# EAGLE design analog_rev_1 (EAGLE 6.3)
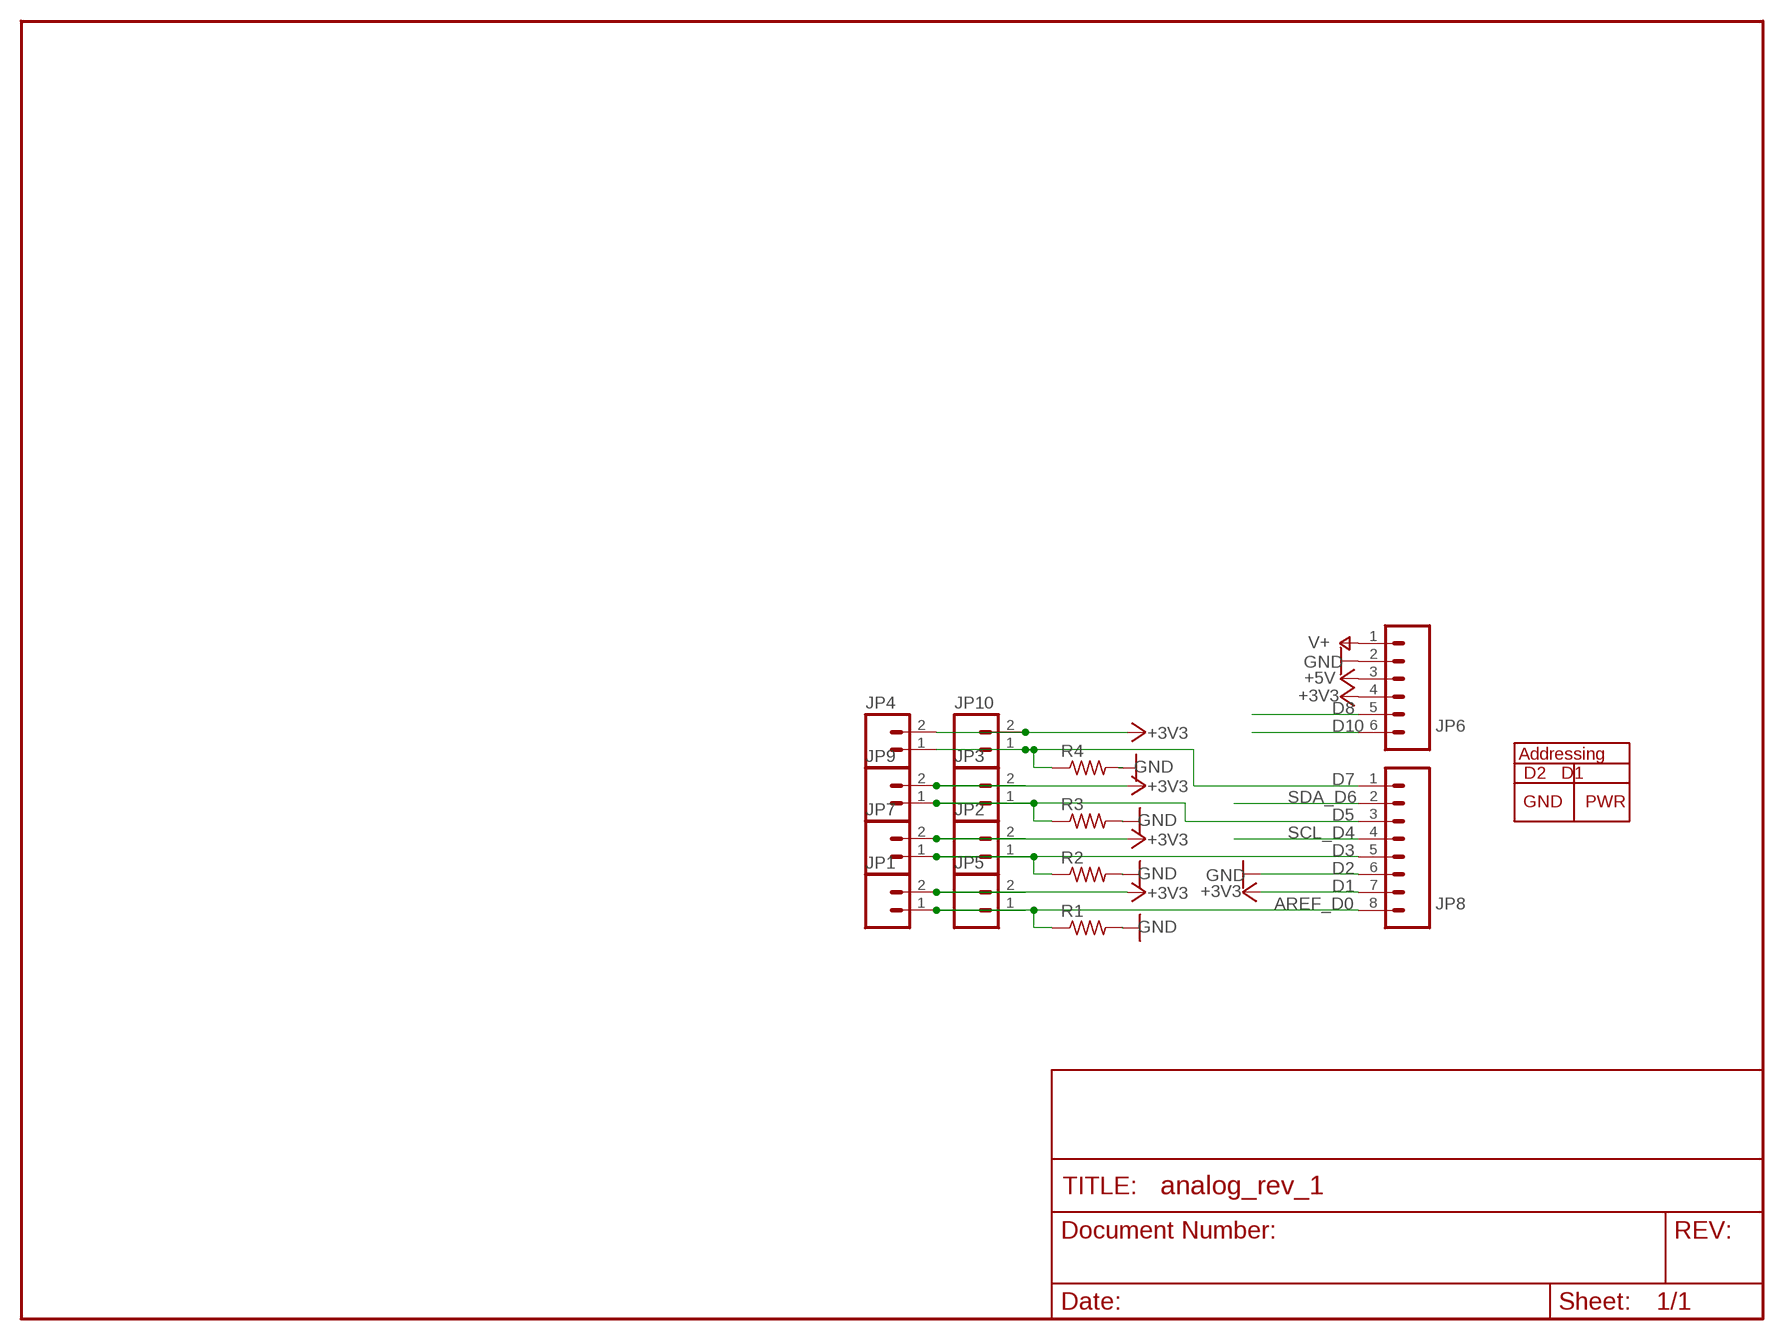
[diagram p0: schematic, sheet 1]

## Parts
JP1  M02PTH  [1X02]
JP2  M02PTH  [1X02]
JP3  M02PTH  [1X02]
JP4  M02PTH  [1X02]
JP5  M02PTH  [1X02]
JP6  M06SIP  [1X06]
JP7  M02PTH  [1X02]
JP8  M081X08  [1X08]
JP9  M02PTH  [1X02]
JP10  M02PTH  [1X02]
R1  R-US_0204/7  [0204/7]
R2  R-US_0204/7  [0204/7]
R3  R-US_0204/7  [0204/7]
R4  R-US_0204/7  [0204/7]

## Nets
+5V: JP6.3
AREF_D0: JP1.1 JP5.1 JP8.8 R1.1
D1: JP1.2 JP2.2 JP3.2 JP4.2 JP5.2 JP6.4 JP7.2 JP8.7 JP9.2 JP10.2 ; supply symbol labelled +3V3
D2: JP8.6 ; supply symbol labelled GND
D3: JP2.1 JP7.1 JP8.5 R2.1
D5: JP3.1 JP8.3 JP9.1 R3.1
D7: JP4.1 JP8.1 JP10.1 R4.1
D8: JP6.5
D10: JP6.6
GND: JP6.2 R1.2 R2.2 R3.2 R4.2
SCL_D4: JP8.4
SDA_D6: JP8.2
V+: JP6.1

## Library data of the parts
JP1-JP5 JP7 JP9 JP10 = SparkFun:M02: Header 2 Standard 2-pin 0.1" header. Use with straight break away headers (SKU : PRT-00116), right angle break away headers (PRT-00553), swiss pins (PRT-00743), machine pins (PRT-00117), and female headers (PRT-00115). Molex polarized connector foot print use with SKU : PRT-08233 with associated crimp pins and housings.
JP6 = SparkFun:M06: Header 6 Standard 6-pin 0.1" header. Use with straight break away headers (SKU : PRT-00116), right angle break away headers (PRT-00553), swiss pins (PRT-00743), machine pins (PRT-00117), and female headers (PRT-00115). Molex polarized connector foot print use with SKU : PRT-08094 with associated crimp pins and housings. NOTES ON THE VARIANTS LOCK and LOCK_LONGPADS... This footprint was designed to help hold the alignment of a through-hole component (i.e. 6-pin header) while soldering it into place. You may notice that each hole has been shifted either up or down by 0.005 of an inch from it's more standard position (which is a perfectly straight line). This slight alteration caused the pins (the squares in the middle) to touch the edges of the holes. Because they are alternating, it causes a "brace" to hold the component in place. 0.005 has proven to be the perfect amount of "off-center" position when using our standard breakaway headers. Although looks a little odd when you look at the bare footprint, once you have a header in there, the alteration is very hard to notice. Also, if you push a header all the way into place, it is covered up entirely on the bottom side. This idea of altering the position of holes to aid alignment will be further integrated into the Sparkfun Library for other footprints. It can help hold any component with 3 or more connection pins.
JP8 = SparkFun:M08: Header 8 Standard 8-pin 0.1" header. Use with straight break away headers (SKU : PRT-00116), right angle break away headers (PRT-00553), swiss pins (PRT-00743), machine pins (PRT-00117), and female headers (PRT-00115).
R1-R4 = adafruit_mod:R-US_: RESISTOR, American symbol

## Board
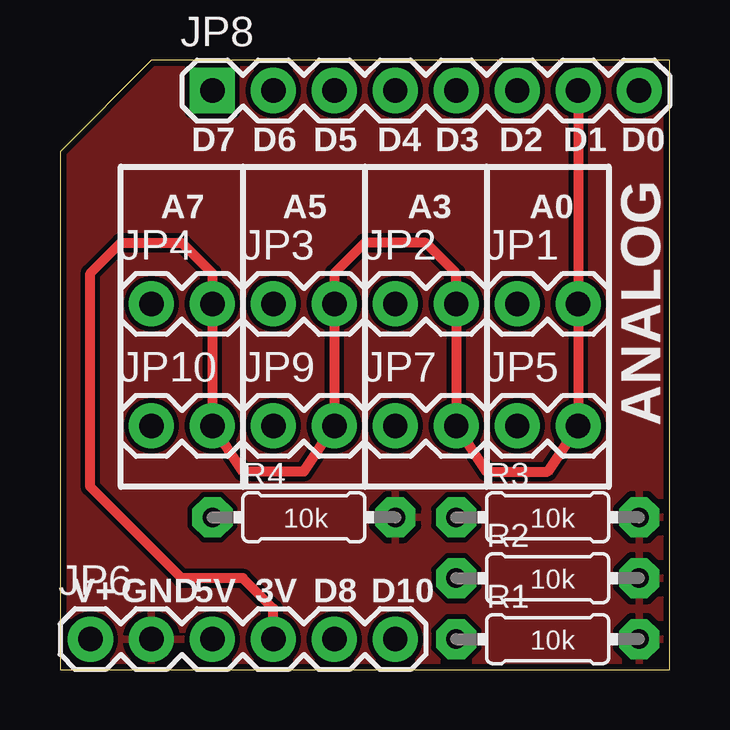
[diagram p1: board, top side]
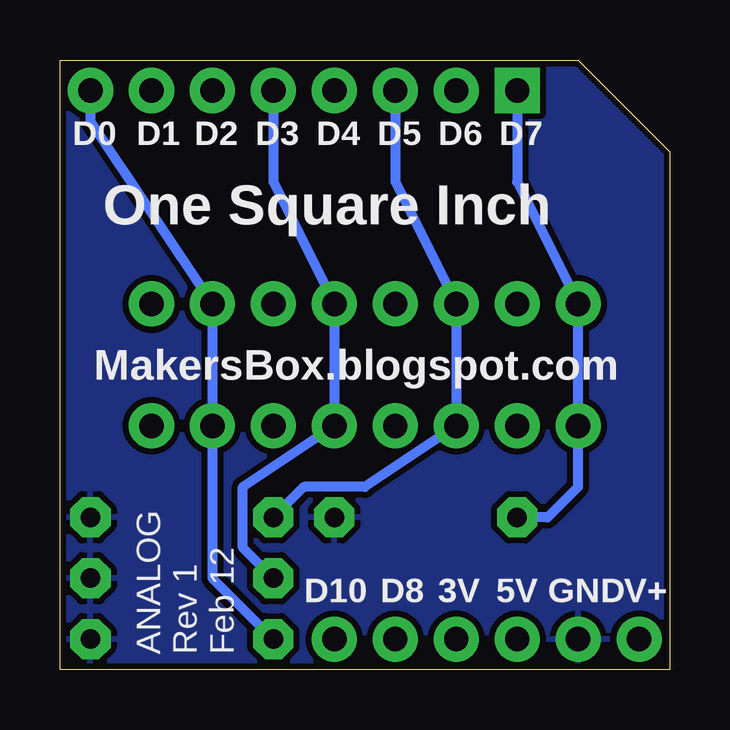
[diagram p2: board, bottom side, seen from below]

Size 25.4 x 25.4 mm. Coordinates in mm from the lower left corner, seen from the top.
Outline: 25.4,25.4 25.4,21.59 25.4,0 24.77,0 24.77,0 0,0 0,21.59
Outline: 25.4,25.4 3.81,25.4 0,21.59
Outline: 0,21.59 0,21.59
Copper layers (1*16): Top 0.035mm / dielectric 1.5mm / Bottom 0.035mm
Design rules "SparkFun": minimum track width 8mil, minimum drill 20mil, track to track 8mil, track to pad 8mil, pad to pad 8mil, via to via 8mil, smd to smd 8mil, copper to edge 10mil, drill to drill 8mil, minimum pad ring 12mil, minimum via ring 10mil, stop-mask expansion 4mil, vias tented up to drill 25mil, thermal gap 10mil

### Footprints (pad centres in the part's own frame; a part is rotated, then mirrored left to right if it is on the bottom)
1X02 = drill 1.016 pad 1.88: 1 0,0; 2 2.54,0
1X06 = drill 1.016 pad 1.88: 1 0,0; 2 2.54,0; 3 5.08,0; 4 7.62,0; 5 10.16,0; 6 12.7,0
1X08 = drill 1.016 pad 1.88 square: 1 0,0 | drill 1.016 pad 1.88: 2 2.54,0; 3 5.08,0; 4 7.62,0; 5 10.16,0; 6 12.7,0; 7 15.24,0; 8 17.78,0
0204/7 = drill 0.813 pad 1.676 octagon: 1 -3.81,0; 2 3.81,0

### Placement (x,y rotation side)
JP1  19.05,15.24 0 top
JP2  13.97,15.24 0 top
JP3  8.89,15.24 0 top
JP4  3.81,15.24 0 top
JP5  19.05,10.16 0 top
JP6  1.27,1.27 0 top
JP7  13.97,10.16 0 top
JP8  6.35,24.13 0 top
JP9  8.89,10.16 0 top
JP10  3.81,10.16 0 top
R1  20.32,1.27 0 top
R2  20.32,3.81 0 top
R3  20.32,6.35 0 top
R4  10.16,6.35 0 top

### Tracks (layer width: path | path; a pad name or v marks a point on that pad's centre or on a via)
AREF_D0
  Bottom 0.406: JP8.8 24.13,22.86 JP1.1 JP5.1 19.05,3.81 R1.1
D1
  Top 0.406: JP8.7 JP1.2 JP5.2 20.32,8.26 17.78,8.26 JP7.2 JP2.2 16.51,16.51 15.24,17.78 12.7,17.78 11.43,16.51 JP3.2 JP9.2 10.16,8.26 7.62,8.26 JP10.2 JP4.2 6.35,16.51 5.08,17.78 2.54,17.78 1.27,16.51 1.27,7.62 5.08,3.81 7.62,3.81 8.89,2.54 JP6.4
D3
  Bottom 0.406: JP8.5 16.51,20.32 JP2.1 JP7.1 17.78,7.62 17.78,5.08 R2.1
D5
  Bottom 0.406: JP8.3 11.43,20.32 JP3.1 JP9.1 12.7,7.62 15.24,7.62 R3.1
D7
  Bottom 0.406: JP8.1 6.35,20.32 JP4.1 JP10.1 3.81,7.62 5.08,6.35 R4.1
GND
  pour Bottom (isolate 0.254): -1.27,26.67 26.67,26.67 26.67,-1.27 -1.27,-1.27
  pour Top: -0.64,26.04 26.67,26.04 26.67,0 26.04,-0.64 -0.64,-0.64

### Text on the board
tPlace: D7 | D6 | D5 | D4 | D3 | D2 | D1 | D0 | A7 | A5 | A3 | A0 | ANALOG | 10k | 10k | 10k | V+ | GND | 5V | 3V | D8 | D10 | 10k
bPlace: D7 | D6 | D5 | D4 | D3 | D2 | D1 | D0 | One Square Inch | MakersBox.blogspot.com | V+ | GND | 5V | 3V | D8 | D10 | ANALOG / Rev 1 / Feb 12